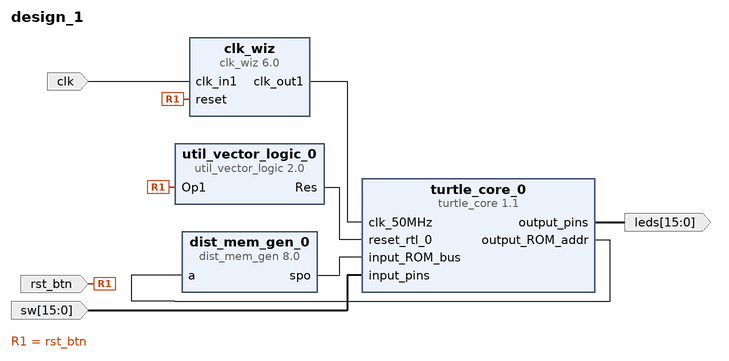
[diagram p0: block diagram of the top level]
# Vivado block design design_1, xc7a35tcpg236-1, Vivado 2024.1
create_bd_design design_1

create_bd_port -dir I -type clk clk
set_property -dict {CONFIG.FREQ_HZ 100000000} [get_bd_ports clk]
create_bd_port -dir I -type rst rst_btn
set_property -dict {CONFIG.POLARITY ACTIVE_HIGH} [get_bd_ports rst_btn]
create_bd_port -dir O -from 15 -to 0 -type data leds
create_bd_port -dir I -from 15 -to 0 -type data sw

create_bd_cell -type ip -vlnv user.org:user:turtle_core:1.1 turtle_core_0
create_bd_cell -type ip -vlnv xilinx.com:ip:clk_wiz:6.0 clk_wiz
set_property -dict [list \
  CONFIG.CLKOUT1_DRIVES BUFG \
  CONFIG.CLKOUT1_JITTER 151.636 \
  CONFIG.CLKOUT1_PHASE_ERROR 98.575 \
  CONFIG.CLKOUT1_REQUESTED_OUT_FREQ 50 \
  CONFIG.CLKOUT2_DRIVES BUFG \
  CONFIG.CLKOUT3_DRIVES BUFG \
  CONFIG.CLKOUT4_DRIVES BUFG \
  CONFIG.CLKOUT5_DRIVES BUFG \
  CONFIG.CLKOUT6_DRIVES BUFG \
  CONFIG.CLKOUT7_DRIVES BUFG \
  CONFIG.ENABLE_CLOCK_MONITOR false \
  CONFIG.FEEDBACK_SOURCE FDBK_AUTO \
  CONFIG.MMCM_BANDWIDTH OPTIMIZED \
  CONFIG.MMCM_CLKFBOUT_MULT_F 10.000 \
  CONFIG.MMCM_CLKOUT0_DIVIDE_F 20.000 \
  CONFIG.MMCM_COMPENSATION ZHOLD \
  CONFIG.MMCM_DIVCLK_DIVIDE 1 \
  CONFIG.PRIMITIVE MMCM \
  CONFIG.RESET_PORT reset \
  CONFIG.RESET_TYPE ACTIVE_HIGH \
  CONFIG.USE_LOCKED false \
  CONFIG.USE_RESET true \
] [get_bd_cells clk_wiz]
create_bd_cell -type ip -vlnv xilinx.com:ip:dist_mem_gen:8.0 dist_mem_gen_0
set_property -dict [list \
  CONFIG.coefficient_file ../../../../../../../out.coe \
  CONFIG.data_width 8 \
  CONFIG.depth 32768 \
  CONFIG.input_options non_registered \
  CONFIG.memory_type rom \
  CONFIG.single_port_output_clock_enable false \
] [get_bd_cells dist_mem_gen_0]
create_bd_cell -type ip -vlnv xilinx.com:ip:util_vector_logic:2.0 util_vector_logic_0
set_property -dict {CONFIG.C_OPERATION not CONFIG.C_SIZE 1} [get_bd_cells util_vector_logic_0]

# ---- connections ----

connect_bd_net [get_bd_ports clk] [get_bd_pins clk_wiz/clk_in1]
connect_bd_net -net debounce_clk_Res [get_bd_pins clk_wiz/clk_out1] [get_bd_pins turtle_core_0/clk_50MHz]
connect_bd_net -net debounce_rst_Res [get_bd_ports rst_btn] [get_bd_pins clk_wiz/reset] [get_bd_pins util_vector_logic_0/Op1]
connect_bd_net [get_bd_pins dist_mem_gen_0/spo] [get_bd_pins turtle_core_0/input_ROM_bus]
connect_bd_net -net proc_sys_reset_0_peripheral_aresetn [get_bd_pins util_vector_logic_0/Res] [get_bd_pins turtle_core_0/reset_rtl_0]
connect_bd_net [get_bd_ports sw] [get_bd_pins turtle_core_0/input_pins]
connect_bd_net [get_bd_pins turtle_core_0/output_ROM_addr] [get_bd_pins dist_mem_gen_0/a]
connect_bd_net -net turtle_core_0_output_pin [get_bd_pins turtle_core_0/output_pins] [get_bd_ports leds]

validate_bd_design
save_bd_design
